# EAGLE design rpi-cc2520_a (EAGLE 6.4)
REV: A; TITLE: RPi + CC2520
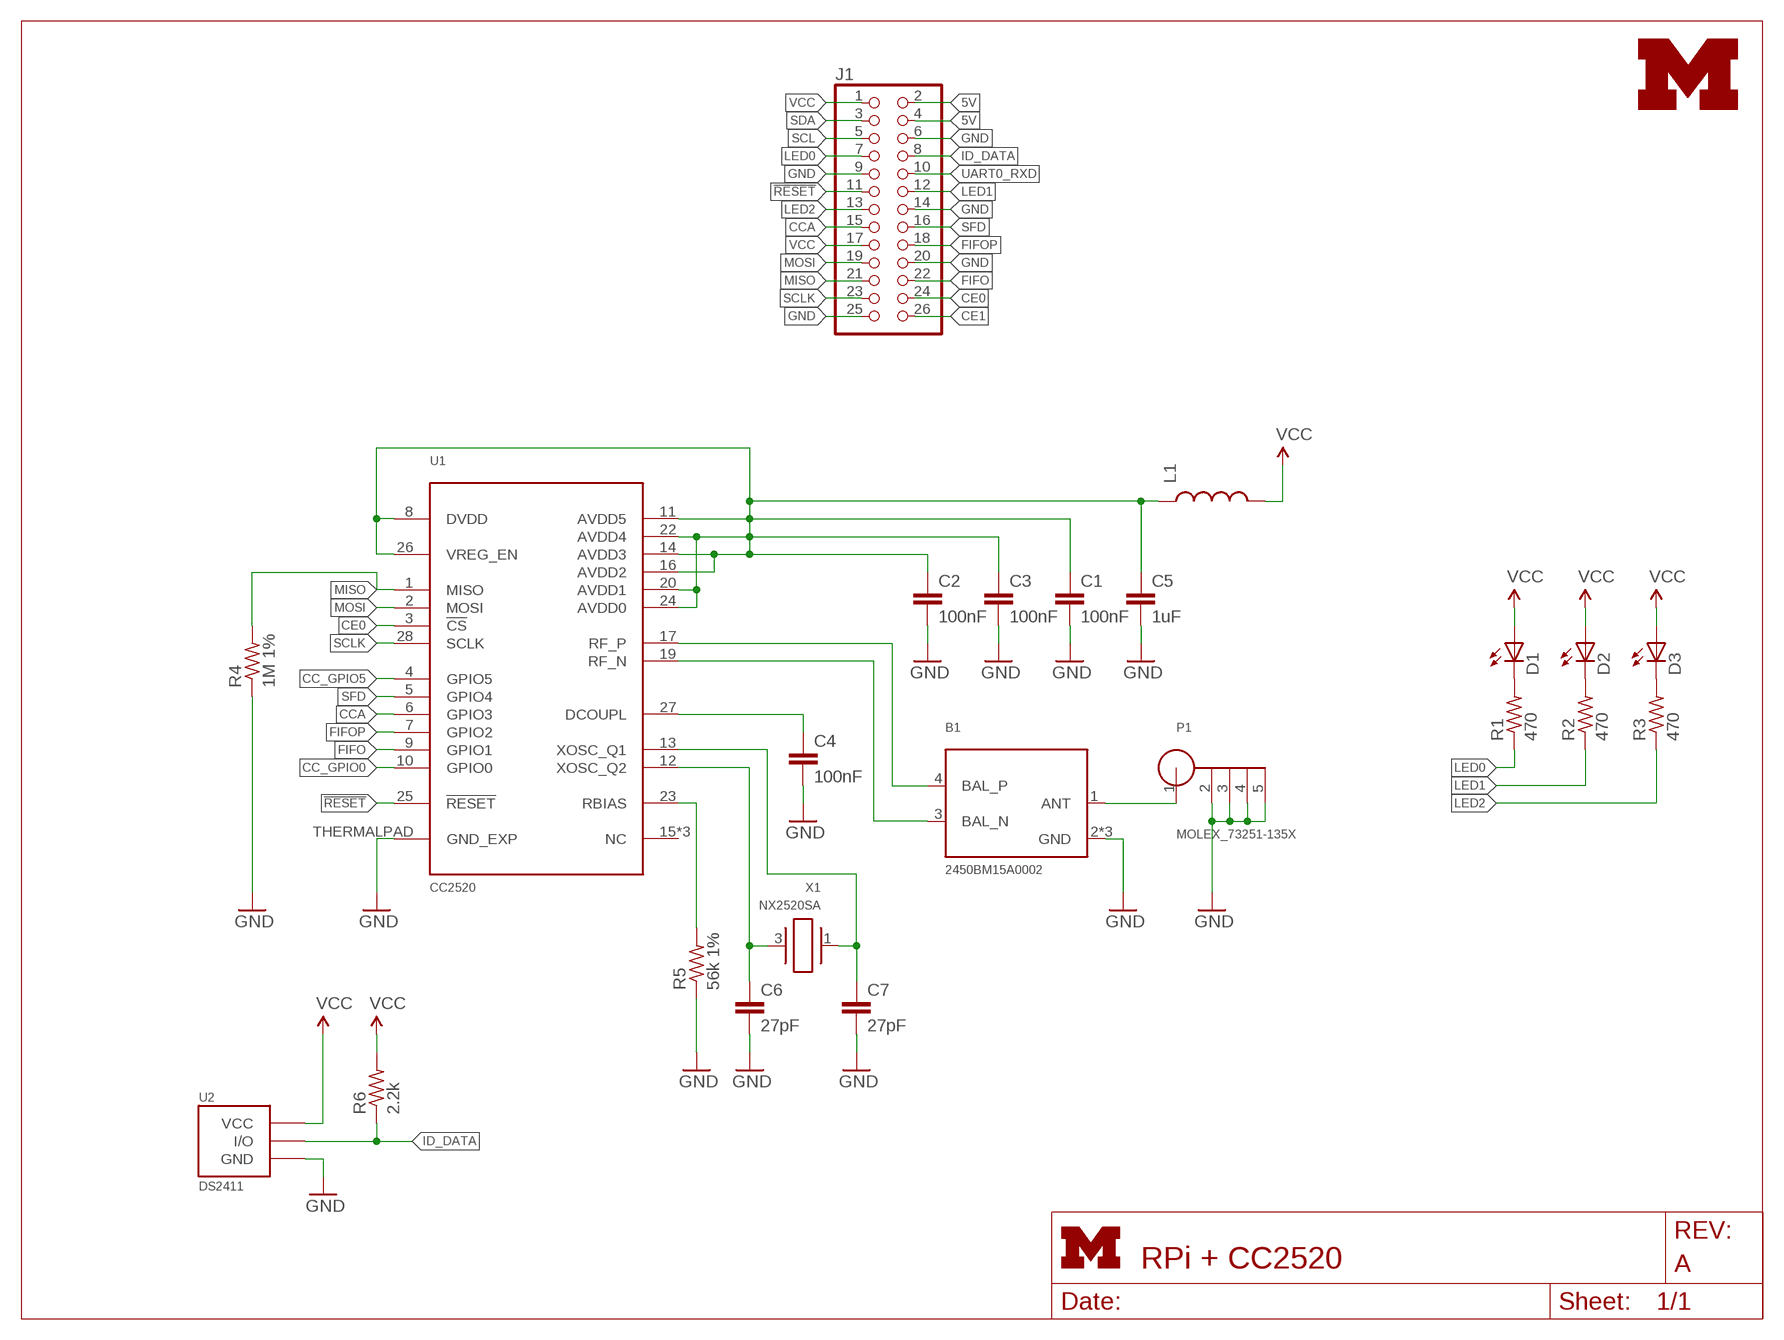
[diagram p0: schematic, sheet 1]
FRAME1 (LETTER_L): HEIGHT: 8.5in; WIDTH: 11in

## Parts
B1  2450BM15A0002  [2450BM]
C1  100nF  C-EUC0402  [C0402]
C2  100nF  C-EUC0402  [C0402]
C3  100nF  C-EUC0402  [C0402]
C4  100nF  C-EUC0402  [C0402]
C5  1uF  C-EUC0603  [C0603]
C6  27pF  C-EUC0402  [C0402]
C7  27pF  C-EUC0402  [C0402]
D1  LED0603  [LED-0603]
D2  LED0603  [LED-0603]
D3  LED0603  [LED-0603]
J1  PINHD-2X13  [2X13]
L1  INDUCTOR0603  [0603]
P1  MOLEX_73251-135X  [SMA-J/PCB]
R1  470  R-US_R0402  [R0402]
R2  470  R-US_R0402  [R0402]
R3  470  R-US_R0402  [R0402]
R4  1M 1%  R-US_R0402  [R0402]
R5  56k 1%  R-US_R0402  [R0402]
R6  2.2k  R-US_R0402  [R0402]
U1  CC2520  [S-PVQFN-N28]
U2  DS2411  [SOT-23]
U$1  UMICH_SOLID_SMALL  [UMICH_SOLID_75MIL]
X1  NX2520SA  [NX2520SA]

## Nets
5V: J1.2 J1.4
!RESET: J1.11 U1.25(!RESET)
CC_GPIO0: U1.10(GPIO0)
CC_GPIO5: U1.4(GPIO5)
CCA: J1.15 U1.6(GPIO3)
CE0: J1.24 U1.3(!CS)
CE1: J1.26
FIFO: J1.22 U1.9(GPIO1)
FIFOP: J1.18 U1.7(GPIO2)
GND: B1.2(GND) B1.5(GND) B1.6(GND) C1.2 C2.2 C3.2 C4.2 C5.2 C6.2 C7.2 J1.6 J1.9 J1.14 J1.20 J1.25 P1.2 P1.3 P1.4 P1.5 R4.1 R5.1 U1.THERMALPAD(GND_EXP) U2.3(GND)
ID_DATA: J1.8 R6.1 U2.1(I/O)
LED0: J1.7 R1.1
LED1: J1.12 R2.1
LED2: J1.13 R3.1
MISO: J1.21 R4.2 U1.1(MISO)
MOSI: J1.19 U1.2(MOSI)
N$1: D1.C R1.2
N$2: D2.C R2.2
N$3: D3.C R3.2
N$5: C1.1 C2.1 C3.1 C5.1 L1.1 U1.8(DVDD) U1.11(AVDD5) U1.14(AVDD3) U1.16(AVDD2) U1.20(AVDD1) U1.22(AVDD4) U1.24(AVDD0) U1.26(VREG_EN)
N$7: B1.1(ANT) P1.1
N$11: C7.1 U1.13(XOSC_Q1) X1.1
N$12: C4.1 U1.27(DCOUPL)
N$13: C6.1 U1.12(XOSC_Q2) X1.3
N$14: R5.2 U1.23(RBIAS)
RF_N: B1.3(BAL_N) U1.19(RF_N)
RF_P: B1.4(BAL_P) U1.17(RF_P)
SCL: J1.5
SCLK: J1.23 U1.28(SCLK)
SDA: J1.3
SFD: J1.16 U1.5(GPIO4)
UART0_RXD: J1.10
VCC: D1.A D2.A D3.A J1.1 J1.17 L1.2 R6.2 U2.2(VCC)
Unconnected: U1.15(NC) U1.18(NC) U1.21(NC)

## Library data of the parts
B1 = rpi-cc2520:2450BM15A0002: BALUN JTI MATCHED ZIGBEE; DIGIKEY: 712-1536-1-ND
C1-C4 = rcl:C-EU: CAPACITOR, European symbol; DIGIKEY: 490-1318-1-ND
C5 = rcl:C-EU: CAPACITOR, European symbol; DIGIKEY: 490-1550-1-ND
C6 C7 = rcl:C-EU: CAPACITOR, European symbol; DIGIKEY: 490-5869-1-ND
D1 = SparkFun-LED:LED: LEDs Standard schematic elements and footprints for 5mm, 3mm, 1206, and 0603 sized LEDs. 5mm - Spark Fun Electronics SKU : COM-00529 (and others); DIGIKEY: 160-1834-1-ND
D2 = SparkFun-LED:LED: LEDs Standard schematic elements and footprints for 5mm, 3mm, 1206, and 0603 sized LEDs. 5mm - Spark Fun Electronics SKU : COM-00529 (and others); DIGIKEY: 160-1835-1-ND
D3 = SparkFun-LED:LED: LEDs Standard schematic elements and footprints for 5mm, 3mm, 1206, and 0603 sized LEDs. 5mm - Spark Fun Electronics SKU : COM-00529 (and others); DIGIKEY: 160-1837-1-ND
J1 = pinhead:PINHD-2X13: PIN HEADER; DIGIKEY: SAM1204-13-ND
L1 = SparkFun-Passives:INDUCTOR: Inductors Basic Inductor/Choke - 0603 and 1206. Footprints are not proven and vary greatly between part numbers.; DIGIKEY: 490-1015-1-ND
P1 = connector:MOLEX_73251-135X: SMA JACK SMT 50 OHM; DIGIKEY: WM9357-ND
R1-R3 = rcl:R-US_: RESISTOR, American symbol; DIGIKEY: RHM470JCT-ND
R4 = rcl:R-US_: RESISTOR, American symbol; DIGIKEY: RHM1.00MCDCT-ND
R5 = rcl:R-US_: RESISTOR, American symbol; DIGIKEY: P56.0KLCT-ND
R6 = rcl:R-US_: RESISTOR, American symbol; DIGIKEY: RHM2.2KCECT-ND
U1 = chips:CC2520: 2.4 GHZ IEEE 802.15.4/ZIGBEE® RF TRANSCEIVER; DIGIKEY: 296-22996-1-ND
U2 = chips:DS2411: Maxim DS2411 Silicon Serial Number with VCC Input; DIGIKEY: DS2411R+CT-ND
U$1 = logos:UMICH_SOLID
X1 = rpi-cc2520:NX2520SA: CRYSTAL 32MHZ 10PF SMD; DIGIKEY: 644-1065-1-ND

## Board
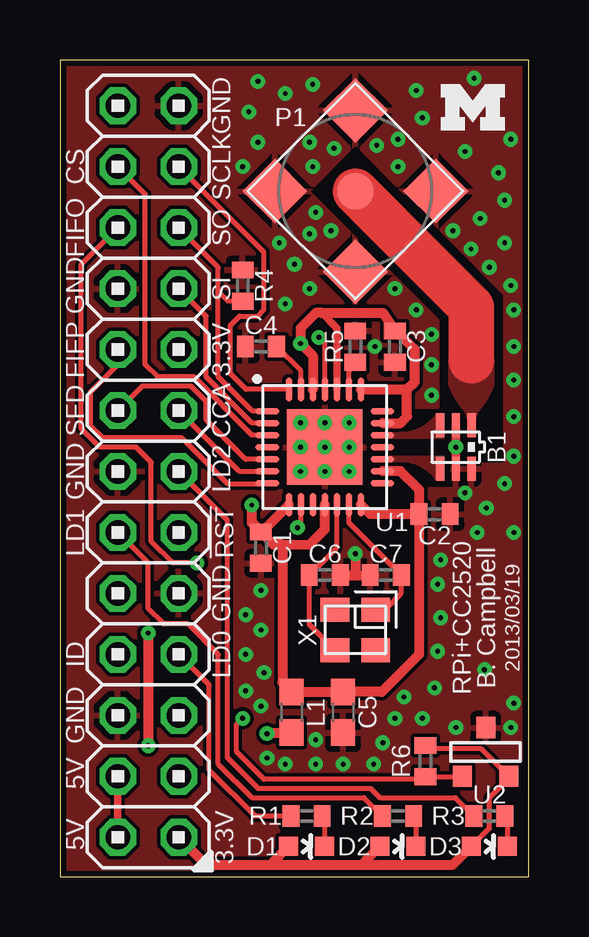
[diagram p1: board, top side]
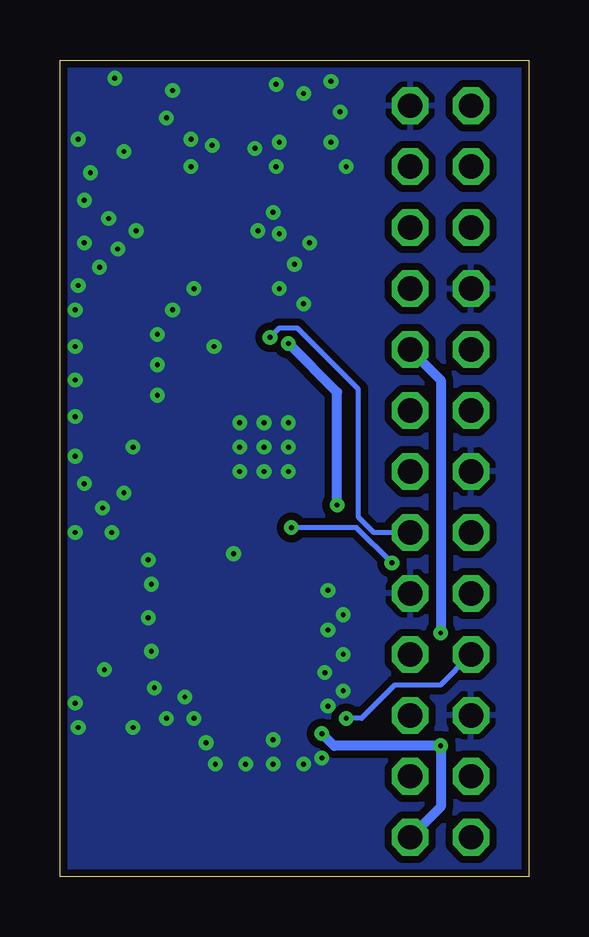
[diagram p2: board, bottom side, seen from below]

Size 19.56 x 34.04 mm. Coordinates in mm from the lower left corner, seen from the top.
Outline: 0,0 19.56,0 19.56,34.04 0,34.04 0,0
Copper layers (1*16): Top 0.0178mm / dielectric 59mil / Bottom 0.0178mm
Design rules "sunstone-2lyr_v1.0.0.3 *": minimum track width 6mil, minimum drill 14mil, track to track 6mil, track to pad 6mil, pad to pad 6mil, via to via 6mil, smd to smd 6mil, copper to edge 10mil, drill to drill 16mil, minimum pad ring 8mil, minimum via ring 8mil, stop-mask expansion 3mil, vias tented up to drill 10mil, thermal gap 10mil

### Footprints (pad centres in the part's own frame; a part is rotated, then mirrored left to right if it is on the bottom)
2450BM = smd 0.35 x 1: 1 0.65,0.9; 2 0,0.9; 3 -0.65,0.9; 4 -0.65,-0.9; 5 0,-0.9; 6 0.65,-0.9
C0402 = smd 0.7 x 0.9: 1 -0.65,0; 2 0.65,0
C0603 = smd 1.1 x 1: 1 -0.85,0; 2 0.85,0
LED-0603 = smd 0.8 x 0.8: A 0,-0.75; C 0,0.75
2X13 = drill 1.016 octagon: 1 -15.24,-1.27; 2 -15.24,1.27; 3 -12.7,-1.27; 4 -12.7,1.27; 5 -10.16,-1.27; 6 -10.16,1.27; 7 -7.62,-1.27; 8 -7.62,1.27; 9 -5.08,-1.27; 10 -5.08,1.27; 11 -2.54,-1.27; 12 -2.54,1.27; 13 0,-1.27; 14 0,1.27; 15 2.54,-1.27; 16 2.54,1.27; 17 5.08,-1.27; 18 5.08,1.27; 19 7.62,-1.27; 20 7.62,1.27; 21 10.16,-1.27; 22 10.16,1.27; 23 12.7,-1.27; 24 12.7,1.27; 25 15.24,-1.27; 26 15.24,1.27
0603 = smd 1.1 x 1: 1 -0.85,0; 2 0.85,0
SMA-J/PCB = smd 1.52 x 1.52: 1 0,0 | smd 1.91 x 1.91: 2 -2.375,-2.375; 3 2.375,-2.375; 4 2.375,2.375; 5 -2.375,2.375
R0402 = smd 0.7 x 0.9: 1 -0.65,0; 2 0.65,0
S-PVQFN-N28 = smd 1 x 0.28: 1 -2.4,1.5; 2 -2.4,1; 3 -2.4,0.5; 4 -2.4,0; 5 -2.4,-0.5; 6 -2.4,-1; 7 -2.4,-1.5; 15 2.4,-1.5; 16 2.4,-1; 17 2.4,-0.5; 18 2.4,0; 19 2.4,0.5; 20 2.4,1; 21 2.4,1.5 | smd 0.28 x 1: 8 -1.5,-2.4; 9 -1,-2.4; 10 -0.5,-2.4; 11 0,-2.4; 12 0.5,-2.4; 13 1,-2.4; 14 1.5,-2.4; 22 1.5,2.4; 23 1,2.4; 24 0.5,2.4; 25 0,2.4; 26 -0.5,2.4; 27 -1,2.4; 28 -1.5,2.4 | smd 3.15 x 3.15: THERMALPAD 0,0
SOT-23 = smd 0.787 x 0.889: 1 0.991,1.016; 2 -0.94,1.016; 3 0.025,-1.016
NX2520SA = smd 1.2 x 1: 1 -0.85,-0.85; 2 0.85,-0.85; 3 0.85,0.85; 4 -0.85,0.85

### Placement (x,y rotation side)
B1  16.51,17.91 0 top
C1  8.38,13.72 270 top
C2  15.62,15.11 0 top
C3  13.97,22.1 270 top
C4  8.38,22.1 180 top
C5  11.81,6.86 270 top
C6  11.05,12.57 0 top
C7  13.59,12.57 180 top
D1  10.29,1.27 270 top
D2  14.1,1.27 270 top
D3  17.91,1.27 270 top
J1  3.68,16.89 90 top
L1  9.65,6.86 270 top
P1  12.32,28.57 45 top
R1  10.29,2.54 0 top
R2  14.1,2.54 0 top
R3  17.91,2.54 0 top
R4  7.62,24.64 270 top
R5  12.32,22.1 270 top
R6  15.24,4.83 90 top
U1  11.05,17.91 0 top
U2  17.78,5.21 180 top
U$1  15.88,31.11 0 top
X1  12.32,10.29 180 top

### Tracks (layer width: path | path; a pad name or v marks a point on that pad's centre or on a via)
5V
  Top 0.305: J1.4 J1.2
!RESET  (via drill 0.2)
  Top 0.203: U1.25 11.05,22.23 v10.79,22.48
  Bottom 0.203: J1.11 6.48,14.35 7.11,14.99 7.11,20.32 9.65,22.86 10.41,22.86 v10.79,22.48
CCA
  Top 0.203: U1.6 7.48,16.91 J1.15
CE0
  Top 0.203: J1.24 3.56,28.45 3.56,21.34 4.06,20.83 5.59,20.83 8.01,18.41 U1.3
FIFO  (via drill 0.2)
  Top 0.203: v9.91,14.55 10.05,14.7 U1.9 | J1.22 1.02,25.65 0.89,25.53 0.89,18.67 1.65,17.91 3.17,17.91 3.81,17.27 3.81,13.97 4.7,13.08 v5.71,13.08
  Bottom 0.203: v5.71,13.08 7.19,14.55 v9.91,14.55
FIFOP
  Top 0.203: J1.18 2.41,21.34 1.27,20.19 1.27,18.8 1.78,18.29 5.08,18.29 6.99,16.38 8.62,16.38 U1.7
GND  (via drill 0.2)
  Top 0.35: B1.2 B1.5
  Top 0.406: C6.2 12.32,12.57 | 12.32,12.57 C7.2 | v12.32,13.46 12.32,12.57
  other vias: 11.05,17.91 10.03,18.92 11.05,18.92 12.06,18.92 12.06,17.91 12.06,16.89 11.05,16.89 10.03,16.89 10.03,17.91 13.13,22.1 8.38,11.94 13.46,5.59 8.51,8.51 8.38,10.29 15.11,6.6 18.8,6.22 16.51,6.22 10.67,4.7 13.97,6.6 8.64,4.95 15.88,10.79 15.75,9.4 17.78,15.37 18.54,16.38 17.14,26.16 16.38,26.92 18.8,24.64 18.29,29.34 10.41,24.51 9.78,25.53 7.87,31.88 10.54,33.02 9.4,32.64 14.86,32.77 15.62,7.87 9.4,4.7 11.81,4.7 18.92,23.62 17.91,25.4 18.92,22.1 18.92,20.7 18.92,19.18 18.92,17.53 8.26,30.61 8.26,33.15 9.4,23.88 15.11,31.62 16.89,30.23 18.8,30.73 17.53,27.43 18.54,26.42 18.54,28.19 13.97,24.51 14.86,23.62 15.49,22.61 15.49,21.34 15.49,20.07 13.21,30.48 14.1,30.73 14.1,29.59 11.43,30.35 10.54,29.59 10.41,30.61 10.67,27.69 11.3,26.92 10.41,26.8 7.62,29.59 9.14,26.42 7.75,10.92 7.75,9.27 7.75,7.75 8.38,7.11 14.35,7.49 13.08,4.7 17.7,8.64 10.67,5.71 18.92,7.24 16.51,17.91 16.89,16 17.27,33.27 15.75,12.19 15.88,13.21 18.92,14.35 17.4,14.35
  pour Bottom (isolate 0.305): 0,33.91 19.56,33.91 19.56,0 0,0
  pour Top: 0,0 19.56,0 19.56,17.14 16.38,17.14 16.38,16.13 13.72,16.13 13.72,16.89 12.7,16.89 12.7,19.6 15.74,19.6 15.74,23.15 10.3,28.57 12.32,30.6 18.58,24.3 18.58,17.17 19.56,17.17 19.56,33.91 0,33.91
ID_DATA  (via drill 0.2)
  Top 0.203: U2.1 16.77,4.18 R6.1 15.13,4.06 8.51,4.06 7.37,5.21 7.37,6.35 v7.62,6.6
  Bottom 0.203: J1.8 3.68,8 5.59,8 6.99,6.6 v7.62,6.6
LED0
  Top 0.203: J1.7 6.22,8 6.22,4.45 8.13,2.54 R1.1
LED1
  Top 0.203: J1.12 3.68,13.08 3.68,11.18 4.32,10.54 5.33,10.54 6.6,9.27 6.6,4.7 8,3.3 12.69,3.3 R2.1
LED2
  Top 0.203: J1.13 6.99,14.86 6.99,4.95 8.26,3.68 12.95,3.68 13.34,3.3 16.5,3.3 R3.1
MISO
  Top 0.203: J1.21 6.6,25.4 6.6,24.38 | U1.1 8.03,19.41 6.6,20.83 6.6,24.38 | R4.2 7,23.99 6.6,24.38
MOSI
  Top 0.203: J1.19 6.1,23.37 6.1,20.83 8.02,18.91 U1.2
N$1
  Top 0.203: R1.2 11.04,2.44 D1.C
N$2
  Top 0.203: R2.2 14.85,2.44 D2.C
N$3
  Top 0.203: R3.2 18.66,2.44 D3.C
N$5  (via drill 0.2)
  Top 0.305: 10.92,23.5 11.55,22.85 U1.24
  Top 0.406: 9.27,13.85 10.41,13.84 11.05,14.48 U1.11 | C2.1 12.94,15.11 U1.14 | C2.1 14.99,15.13 14.99,16.13 14.21,16.91 U1.16 | C2.1 14.97,9.26 13.42,7.71 C5.1 L1.1 9.27,8.09 9.27,13.85 | U1.20 14.21,18.91 14.48,19.18 14.48,20.31 | U1.22 14.48,20.31 | 9.27,13.85 | C1.1 8.41,14.37 U1.8 | 9.27,13.85 8.89,13.85 C1.1 | U1.26 10.55,21.71 v10.03,22.23 10.03,22.86 10.67,23.5 10.92,23.5 13.48,23.5 C3.1 | C1.1 8,14.75 v8,15.49 | 14.1,22.75 C3.1 | C3.1 14.02,22.75 14.78,21.99 14.78,20.61 14.48,20.31
  Bottom 0.406: v8,15.49 8,20.19 v10.03,22.23
N$7
  Top 1.905: P1.1 17.16,23.73 17.16,21.5
  pour Top (no thermals): 16.77,19.5 arc-20 16.21,20.5 16.21,21.59 18.11,21.59 18.11,20.5 arc-20 17.55,19.5 arc35 17.34,19 16.98,19 arc35
N$11
  Top 0.203: X1.1 13.55,11.14 14.24,11.83 C7.1 12.05,14.76 U1.13
N$12
  Top 0.203: U1.27 10.05,21.08 C4.1
N$13
  Top 0.203: X1.3 10.4,10.51 C6.1 11.55,13.72 U1.12
N$14
  Top 0.203: U1.23 12.05,21.05 R5.2
RF_N
  Top 0.152: 15.85,18.8 B1.3
  pour Top (no thermals): 13.5,18.55 14.4,18.55 arc50 15.68,19.3 16.04,19.3 16.04,18.27 13.5,18.27
  pour Top (no thermals): 13.5,18.55 14.4,18.55 arc50 15.68,19.3 16.04,19.3 16.04,18.27 13.5,18.27
RF_P
  Top 0.152: B1.4
  pour Top (no thermals): 13.5,17.55 16.04,17.55 16.04,16.51 15.68,16.51 arc50 14.4,17.27 13.5,17.27
SCLK
  Top 0.203: U1.28 7.76,20.31 7.11,20.95 7.11,22.99 7.49,23.37 8.26,23.37 8.51,23.62 8.51,26.04 J1.23
SFD
  Top 0.203: U1.5 7.75,17.4 6.1,19.05 6.1,19.81 5.46,20.45 3.43,20.45 J1.16
VCC  (via drill 0.2)
  Top 0.203: D3.A 17.91,2.02 17.91,3.3 18.72,4.12 U2.2 17.58,5.33 15.38,5.33 R6.2
  Top 0.406: v3.68,10.16 v3.68,5.46 | 9.65,5.84 L1.2 8.68,6.01 v8.64,5.97 | J1.1 6.1,0.51 8.78,0.51 | 8.78,0.51 12.7,0.51 | 12.7,0.51 16.39,0.51 D3.A | D1.A 8.78,0.51 | D2.A 12.7,0.62 12.7,0.51
  Bottom 0.406: J1.17 3.68,20.7 v3.68,10.16 | J1.1 3.68,2.92 v3.68,5.46 8.13,5.46 v8.64,5.97

### Text on the board
tPlace: GND | CS | SCLK | FIFO | SO | GND | SI | FIFP | 3.3V | SFD | CCA | GND | LD2 | LD1 | !RST | GND | RPi+CC2520 | B. Campbell | 2013/03/19 | ID | LD0 | GND | 5V | 5V | 3.3V
tDocu: CE1 | RXD | TXD | SCL | SDA